# EAGLE design scn (EAGLE 9.6.2)

## Sheet 1 of 4
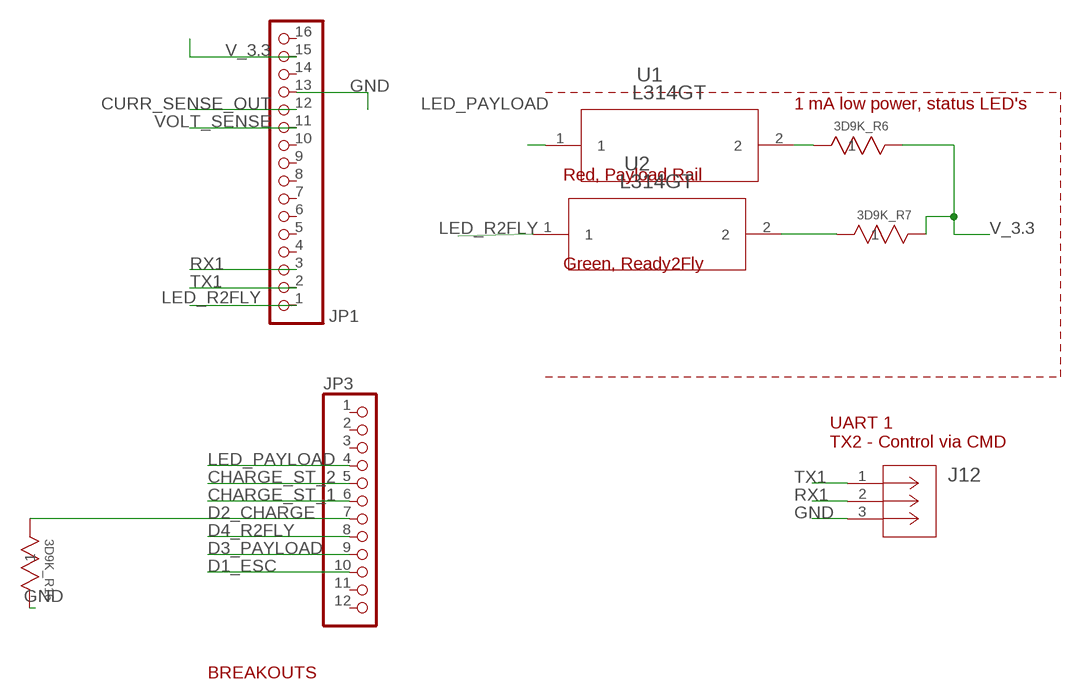
[diagram p0: schematic, sheet 1]

### Parts
3D9K_R6  CF14JT10K0  [STA_CF14_STP]
3D9K_R7  CF14JT10K0  [STA_CF14_STP]
3D9K_R16  CF14JT10K0  [STA_CF14_STP]
J12  B03B-PASK(LF)(SN)  [CONN_B03B-PASK_JST]
JP1  HEADER-1X16ROUND  [1X16_ROUND]
JP3  HEADER-1X12  [1X12_ROUND]
U1  L314GT  [L314GT_AOP]
U2  L314GT  [L314GT_AOP]

### Nets
CHARGE_ST_1: JP3.6 ; also sheet 3
CHARGE_ST_2: JP3.5 ; also sheet 3
CURR_SENSE_OUT: JP1.12 ; also sheet 3
D1_ESC: JP3.10 ; also sheet 3
D2_CHARGE: 3D9K_R16.1 JP3.7 ; also sheet 3
D3_PAYLOAD: JP3.9 ; also sheet 4
D4_R2FLY: JP3.8
GND: 3D9K_R16.2 J12.3 JP1.13 ; also sheet 2,3,4
LED_PAYLOAD: JP3.4 U1.1
LED_R2FLY: JP1.1 U2.1
N$9: 3D9K_R6.1 U1.2
N$11: 3D9K_R7.1 U2.2
RX1: J12.2 JP1.3
TX1: J12.1 JP1.2
V_3.3: 3D9K_R6.2 3D9K_R7.2 JP1.15 ; also sheet 3,4
VOLT_SENSE: JP1.11
Unconnected: JP1.4 JP1.5 JP1.6 JP1.7 JP1.8 JP1.9 JP1.10 JP1.14 JP1.16 JP3.1 JP3.2 JP3.3 JP3.11 JP3.12

### Notes on the sheet
- 1 mA low power, status LED's
- Red, Payload Rail
- Green, Ready2Fly
- UART 1
  TX2 - Control via CMD
- BREAKOUTS

## Sheet 2 of 4
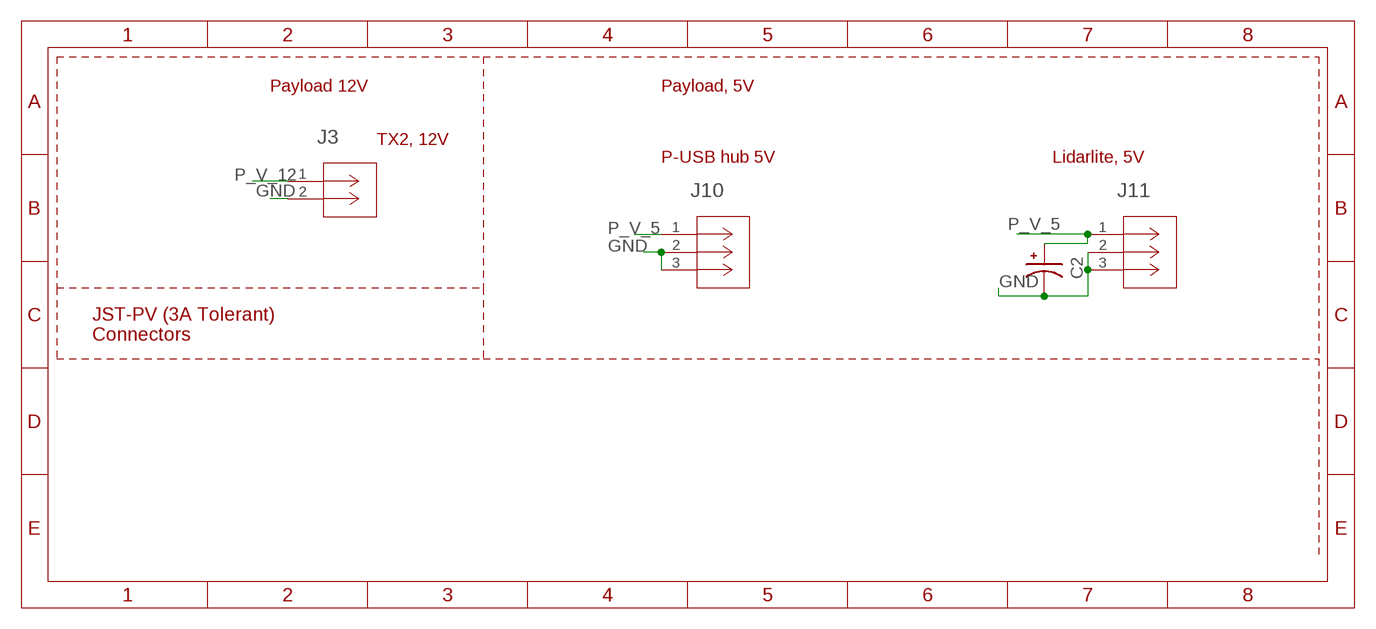
[diagram p1: schematic, sheet 2]

### Parts
C2  ECA1CM471  [CAPPRD350W60D800H1150]
J3  B02B-PASK(LF)(SN)  [CONN_B02B-PASK(LF)(SN)_JST]
J10  B03B-PASK(LF)(SN)  [CONN_B03B-PASK_JST]
J11  B03B-PASK(LF)(SN)  [CONN_B03B-PASK_JST]

### Nets
GND: C2.N J3.2 J10.2 J10.3 J11.2 J11.3 ; also sheet 1,3,4
P_V_5: C2.P J10.1 J11.1 ; also sheet 4
P_V_12: J3.1 ; also sheet 3,4

### Notes on the sheet
- Payload 12V | Payload, 5V
- TX2, 12V
- P-USB hub 5V | Lidarlite, 5V
- JST-PV (3A Tolerant)
  Connectors

## Sheet 3 of 4
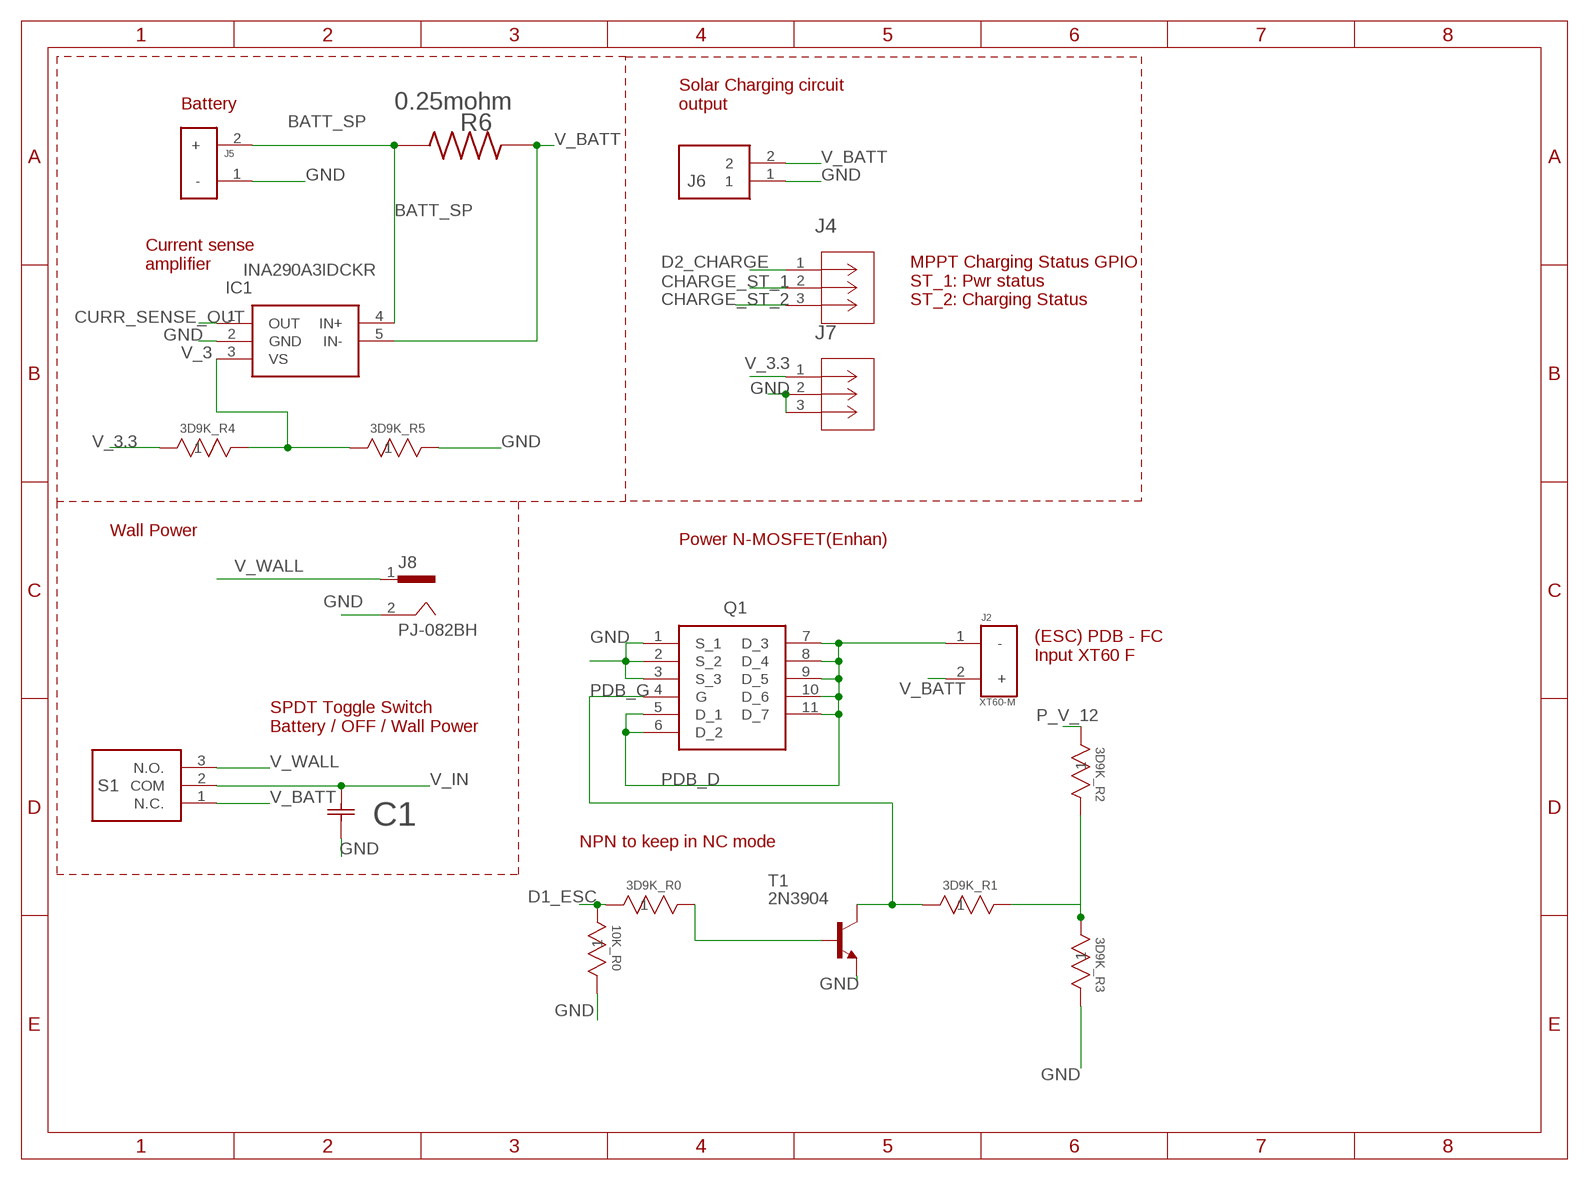
[diagram p2: schematic, sheet 3]

### Parts
3D9K_R0  CF14JT10K0  [STA_CF14_STP]
3D9K_R1  CF14JT10K0  [STA_CF14_STP]
3D9K_R2  CF14JT10K0  [STA_CF14_STP]
3D9K_R3  CF14JT10K0  [STA_CF14_STP]
3D9K_R4  CF14JT10K0  [STA_CF14_STP]
3D9K_R5  CF14JT10K0  [STA_CF14_STP]
10K_R0  CF14JT10K0  [STA_CF14_STP]
C1  25PX1000MEFCT810X16  [CAP_PK/PZ_10X16_LOW_RUB]
IC1  INA290A3IDCKR  [SOT65P210X110-5N]
J2  XT60-M  [AMASS_XT60-M]
J4  B03B-PASK(LF)(SN)  [CONN_B03B-PASK_JST]
J5  XT60-M  [AMASS_XT60-M]
J6  XT30UPB-M  [SHDR2W160P0X500_1X2_1020X520X1]
J7  B03B-PASK(LF)(SN)  [CONN_B03B-PASK_JST]
J8  PJ-082BH  [CUI_PJ-082BH]
Q1  SIRA50DP-T1-RE3  [SI7852ADPT1GE3]
R6  0.25mohm  CSS2725FTL250  [RESC6864X124N]
S1  48ASSP3S1M2QBT  [48ASSP3S1M2QBT]
T1  2N3904  [TO92]

### Nets
BATT_SP: IC1.4(IN+) J5.2(+) R6.1
CHARGE_ST_1: J4.2 ; also sheet 1
CHARGE_ST_2: J4.3 ; also sheet 1
CURR_SENSE_OUT: IC1.1(OUT) ; also sheet 1
D1_ESC: 3D9K_R0.1 10K_R0.1 ; also sheet 1
D2_CHARGE: J4.1 ; also sheet 1
GND: 3D9K_R3.2 3D9K_R5.2 10K_R0.2 C1.2 IC1.2(GND) J5.1(-) J6.1 J7.2 J7.3 J8.2 Q1.1(S_1) Q1.2(S_2) Q1.3(S_3) T1.3(E) ; also sheet 1,2,4
N$1: 3D9K_R1.2 3D9K_R2.2 3D9K_R3.1
N$6: 3D9K_R0.2 T1.2(B)
P_V_12: 3D9K_R2.1 ; also sheet 2,4
PDB_D: J2.1(-) Q1.5(D_1) Q1.6(D_2) Q1.7(D_3) Q1.8(D_4) Q1.9(D_5) Q1.10(D_6) Q1.11(D_7)
PDB_G: 3D9K_R1.1 Q1.4(G) T1.1(C)
V_3: 3D9K_R4.2 3D9K_R5.1 IC1.3(VS)
V_3.3: 3D9K_R4.1 J7.1 ; also sheet 1,4
V_BATT [Full_Voltage]: IC1.5(IN-) J2.2(+) J6.2 R6.2 S1.1(N.C.)
V_IN [v_in]: C1.1 S1.2(COM) ; also sheet 4
V_WALL [Full_Voltage]: J8.1 S1.3(N.O.)

### Notes on the sheet
- Battery
- Solar Charging circuit
  output
- Current sense
  amplifier
- MPPT Charging Status GPIO
  ST_1: Pwr status
  ST_2: Charging Status
- Wall Power
- Power N-MOSFET(Enhan)
- (ESC) PDB - FC 
  Input XT60 F
- SPDT Toggle Switch
  Battery / OFF / Wall Power
- NPN to keep in NC mode

## Sheet 4 of 4
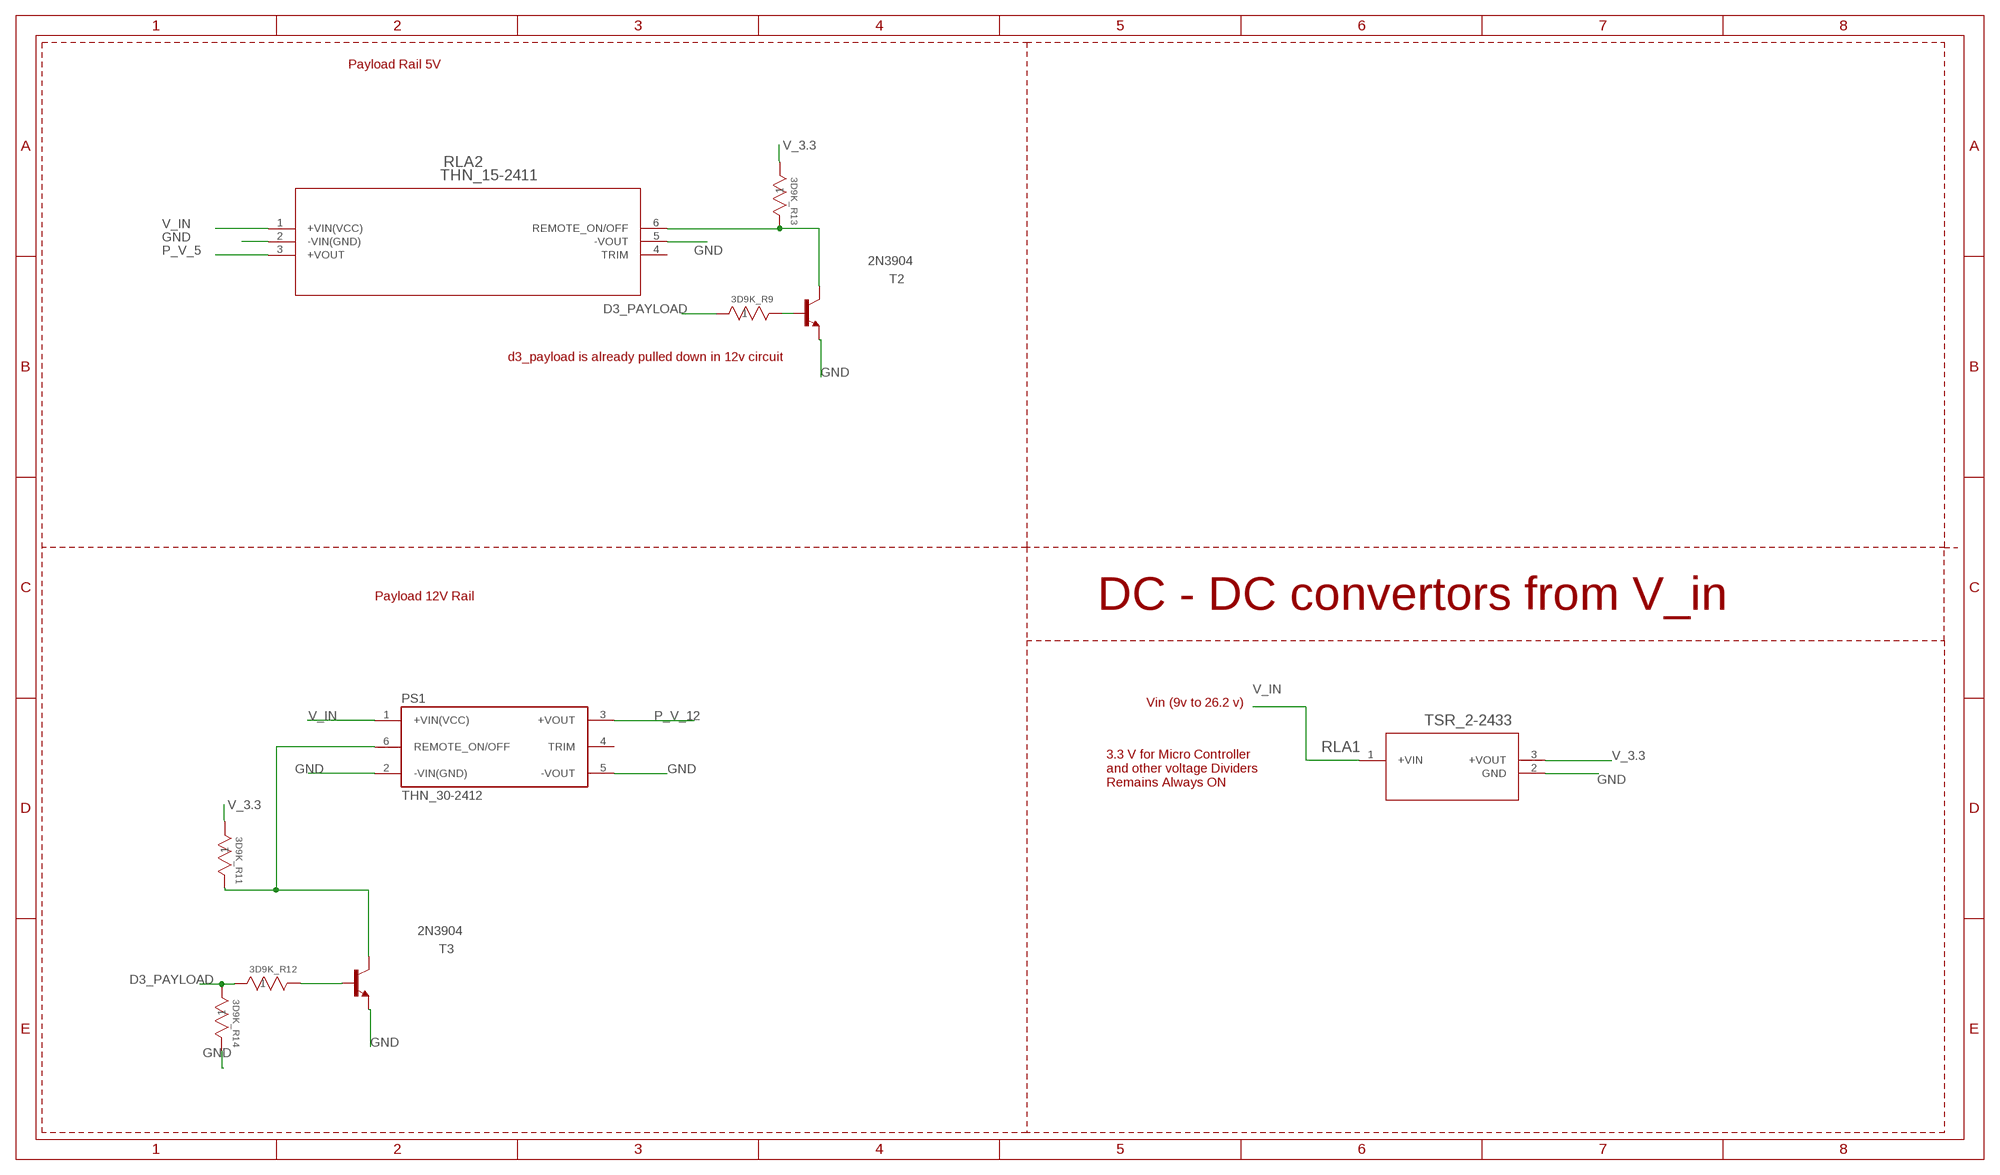
[diagram p3: schematic, sheet 4]

### Parts
3D9K_R9  CF14JT10K0  [STA_CF14_STP]
3D9K_R11  CF14JT10K0  [STA_CF14_STP]
3D9K_R12  CF14JT10K0  [STA_CF14_STP]
3D9K_R13  CF14JT10K0  [STA_CF14_STP]
3D9K_R14  CF14JT10K0  [STA_CF14_STP]
PS1  THN_30-2412  [CONV_THN_30-2412]
RLA1  TSR_2-2433  [TSR2-SINGLE_TRP]
RLA2  THN_15-2411  [THN15-SINGLE_TRP]
T2  2N3904  [TO92]
T3  2N3904  [TO92]

### Nets
D3_PAYLOAD: 3D9K_R9.1 3D9K_R12.1 3D9K_R14.1 ; also sheet 1
GND: 3D9K_R14.2 PS1.2(-VIN(GND)) PS1.5(-VOUT) RLA1.2(GND) RLA2.2(-VIN(GND)) RLA2.5(-VOUT) T2.3(E) T3.3(E) ; also sheet 1,2,3
N$2: 3D9K_R13.2 RLA2.6(REMOTE_ON/OFF) T2.1(C)
N$3: 3D9K_R9.2 T2.2(B)
N$5: 3D9K_R12.2 T3.2(B)
N$7: 3D9K_R11.2 PS1.6(REMOTE_ON/OFF) T3.1(C)
P_V_5: RLA2.3(+VOUT) ; also sheet 2
P_V_12: PS1.3(+VOUT) ; also sheet 2,3
V_3.3: 3D9K_R11.1 3D9K_R13.1 RLA1.3(+VOUT) ; also sheet 1,3
V_IN [v_in]: PS1.1(+VIN(VCC)) RLA1.1(+VIN) RLA2.1(+VIN(VCC)) ; also sheet 3
Unconnected: PS1.4(TRIM) RLA2.4(TRIM)

### Notes on the sheet
- Payload Rail 5V
- d3_payload is already pulled down in 12v circuit
- Payload 12V Rail
- DC - DC convertors from V_in
- Vin (9v to 26.2 v)
- 3.3 V for Micro Controller 
  and other voltage Dividers
  Remains Always ON

## Library data of the parts
3D9K_R0 3D9K_R1-3D9K_R7 3D9K_R9 3D9K_R11-3D9K_R14 3D9K_R16 10K_R0 = resistor_through:CF14JT10K0; COPYRIGHT: Copyright (C) 2022 Ultra Librarian. All rights reserved.; DIGI-KEY_PART_NUMBER_1: CF14JT10K0CT-ND; DIGI-KEY_PART_NUMBER_2: CF14JT10K0TR-ND; MANUFACTURER_PART_NUMBER: CF14JT10K0; MFR_NAME: Stackpole International
C1 = al_cap_1000uF:25PX1000MEFCT810X16; COPYRIGHT: Copyright (C) 2022 Ultra Librarian. All rights reserved.; DIGI-KEY_PART_NUMBER_1: 1189-1583-1-ND; DIGI-KEY_PART_NUMBER_2: 1189-1583-3-ND; DIGI-KEY_PART_NUMBER_3: 1189-1583-3-NDL; MANUFACTURER_PART_NUMBER: 25PX1000MEFCT810X16; MFR_NAME: Rubycon
C2 = ECA1CM471:ECA1CM471: M-A; DESCRIPTION: 470F 16V Aluminum Electrolytic Capacitors Radial, Can 2000 Hrs @ 85C; DIGI-KEY_PART_NUMBER: P5141-ND; MF: Panasonic; MP: ECA1CM471; PACKAGE: RADIAL-2 Panasonic; PURCHASE-URL: https://pricing.snapeda.com/search/part/ECA1CM471/?ref=eda
IC1 = INA290A3IDCKR:INA290A3IDCKR: Current Sense Amplifiers 2.7 to 110V, 800kHz, ultra-precise current sense amplifier in small (sc-70) package 5-SC70 -40 to 125 Source: Datasheet <http://www.ti.com/general/docs/lit/getliterature.tsp?genericPartNumber=INA290&fileType=pdf>; DESCRIPTION: Current Sense Amplifiers 2.7 to 110V, 800kHz, ultra-precise current sense amplifier in small (sc-70) package 5-SC70 -40 to 125; HEIGHT: 1.1mm; MANUFACTURER_NAME: Texas Instruments; MANUFACTURER_PART_NUMBER: INA290A3IDCKR; MOUSER_PART_NUMBER: 595-INA290A3IDCKR; MOUSER_PRICE-STOCK: https://www.mouser.co.uk/ProductDetail/Texas-Instruments/INA290A3IDCKR/?qs=sPbYRqrBIVlSd3xQKh8yNQ%3D%3D
J2 J5 = XT60-M:XT60-M: DC supply; XT60; male; PIN:2; for cable; soldered; 60A; 500V; AVAILABILITY: Unavailable; DESCRIPTION: Plug; DC supply; XT60; male; PIN: 2; for cable; soldered; 30A; 500V; MF: AMASS; MP: XT60-M; PACKAGE: Package; PRICE: None
J3 = B02B-PASK:B02B-PASK(LF)(SN); COPYRIGHT: Copyright (C) 2022 Ultra Librarian. All rights reserved.; DIGI-KEY_PART_NUMBER_1: 455-1817-ND; MANUFACTURER_PART_NUMBER: B02B-PASK(LF)(SN); MFR_NAME: JST
J4 J7 J10-J12 = B03B-PASK:B03B-PASK(LF)(SN); COPYRIGHT: Copyright (C) 2022 Ultra Librarian. All rights reserved.; DIGI-KEY_PART_NUMBER_1: 455-1818-ND; MANUFACTURER_PART_NUMBER: B03B-PASK(LF)(SN); MFR_NAME: JST
J6 = XT30UPB-M:XT30UPB-M: Socket; DC supply; XT30; male; PIN: 2; on PCBs; THT; Colour: yellow Source: Datasheet <https://www.tme.eu/Document/4acc913878197f8c2e30d4b8cdc47230/XT30UPB SPEC.pdf>; DESCRIPTION: Socket; DC supply; XT30; male; PIN: 2; on PCBs; THT; Colour: yellow; HEIGHT: 10.7mm; MANUFACTURER_NAME: Amass; MANUFACTURER_PART_NUMBER: XT30UPB-M
J8 = PJ-082BH:PJ-082BH: 2.5 mm Center Pin, 10 A, Right Angle, Through Hole, Shielded, Dc Power Jack Connector Check availability <https://pricing.snapeda.com/parts/PJ-082BH/CUI%20Devices/view-part?ref=eda>; AVAILABILITY: In Stock; CUI_PURCHASE_URL: https://www.cuidevices.com/product/interconnect/connectors/dc-power-connectors/jacks/pj-082bh?utm_source=snapeda.com&utm_medium=referral&utm_campaign=snapedaBOM; DESCRIPTION: 2.5 x 6.5 mm, 10.0 A, Horizontal, Through Hole, Shielded, Dc Power Jack Connector; MF: CUI Devices; MP: PJ-082BH; PACKAGE: None; PRICE: None; PURCHASE-URL: https://pricing.snapeda.com/search/part/PJ-082BH/?ref=eda
JP1 = microbuilder:HEADER-1X16: PIN HEADER
JP3 = microbuilder:HEADER-1X12
PS1 = THN_30-2412:THN_30-2412; DESCRIPTION: 30 Watt DC/DC converter, industrial, 2:1 input, encpasulated, 1.0 x 1.0 metal package; DIGI-KEY_PART_NUMBER: 1951-2307-ND; MF: Traco Power; MP: THN 30-2412; PACKAGE: 1&quot; X 1&quot; Traco Power; PURCHASE-URL: https://pricing.snapeda.com/search/part/THN 30-2412/?ref=eda
Q1 = SIRA50DP-T1-RE3:SIRA50DP-T1-RE3: MOSFET 40V Vds 20V Vgs PowerPAK SO-8 Source: Datasheet <https://ms.componentsearchengine.com/Datasheets/2/SIRA50DP-T1-RE3.pdf>; ARROW_PART_NUMBER: SIRA50DP-T1-RE3; ARROW_PRICE-STOCK: https://www.arrow.com/en/products/sira50dp-t1-re3/vishay; DESCRIPTION: MOSFET 40V Vds 20V Vgs PowerPAK SO-8; HEIGHT: 1.12mm; MANUFACTURER_NAME: Vishay; MANUFACTURER_PART_NUMBER: SIRA50DP-T1-RE3; MOUSER_PART_NUMBER: 78-SIRA50DP-T1-RE3; MOUSER_PRICE-STOCK: https://www.mouser.co.uk/ProductDetail/Vishay-Siliconix/SIRA50DP-T1-RE3/?qs=chTDxNqvsykRqxCKz2maeQ%3D%3D
R6 = CSS2725FTL250:CSS2725FTL250: Res Metal Alloy 2725 0.00025 Ohm 1% 4W ±50ppm/°C Pad SMD Automotive T/R; DESCRIPTION: 250 µOhms ±1% 4W Chip Resistor Nonstandard Automotive AEC-Q200, Current Sense Metal Element; DIGI-KEY_PART_NUMBER: CSS2725FTL250CT-ND; MF: Stackpole Electronics Inc; MP: CSS2725FTL250; PACKAGE: 6864 Stackpole; PURCHASE-URL: https://pricing.snapeda.com/search/part/CSS2725FTL250/?ref=eda
RLA1 = TSR2-2433:TSR_2-2433; BUILT_BY: EMA_Justin; COPYRIGHT: Copyright (C) 2018 Accelerated Designs. All rights reserved; DATASHEET: https://www.tracopower.com/products/tsr2.pdf; MANUFACTURER_PART_NUMBER: TSR 2-2433; SOURCELIBRARY: Traco_Power_2020-06-03; VENDOR: Traco Power
RLA2 = THN_15-2411:THN_15-2411; COPYRIGHT: Copyright (C) 2022 Ultra Librarian. All rights reserved.; DIGI-KEY_PART_NUMBER_1: 1951-1002-ND; MANUFACTURER_PART_NUMBER: THN 15-2411; MFR_NAME: Traco Power
S1 = 48ASSP3S1M2QBT:48ASSP3S1M2QBT: Slide Switches Slide Switch, SPDT, ON-OFF-ON, thru-hole, PC Mount, RoHS Compliant Source: Datasheet <http://www.grayhill.com/assets/1/7/48a_slide.pdf>; ARROW_PART_NUMBER: 48ASSP3S1M2QBT; ARROW_PRICE-STOCK: https://www.arrow.com/en/products/48assp3s1m2qbt/grayhill; DESCRIPTION: Slide Switches Slide Switch, SPDT, ON-OFF-ON, thru-hole, PC Mount, RoHS Compliant; HEIGHT: 11.43mm; MANUFACTURER_NAME: Grayhill; MANUFACTURER_PART_NUMBER: 48ASSP3S1M2QBT; MOUSER_PART_NUMBER: 706-48ASSP3S1M2QBT; MOUSER_PRICE-STOCK: https://www.mouser.co.uk/ProductDetail/Grayhill/48ASSP3S1M2QBT?qs=ls7QRyWmRk4lulZ551e6Sw%3D%3D
T1-T3 = transistor:2N3904: NPN TRANSISTOR
U1 U2 = led_hole:L314GT; COPYRIGHT: Copyright (C) 2022 Ultra Librarian. All rights reserved.; DIGI-KEY_PART_NUMBER_1: 2460-L314GT-ND; MANUFACTURER_PART_NUMBER: L314GT; MFR_NAME: American Opto Plus

## Net classes
2 v_in: width 0.8 mm
3 def: width 0.254 mm

## Board
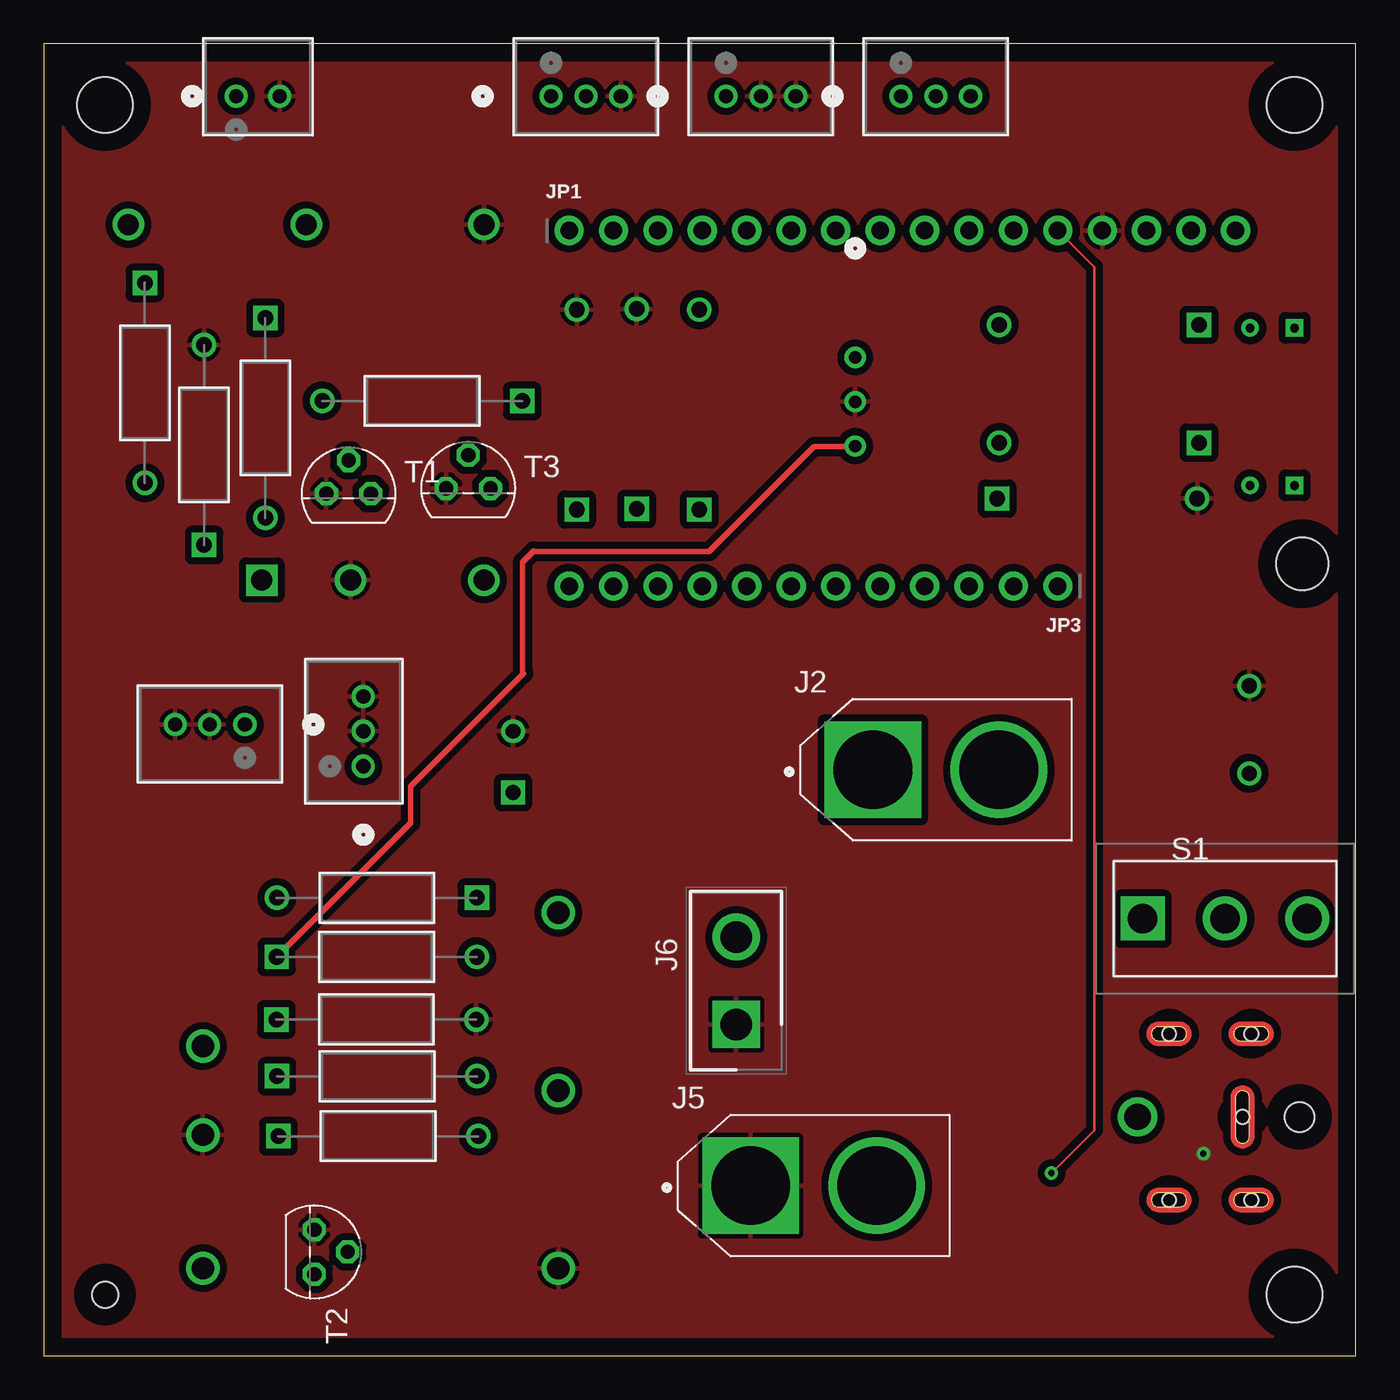
[diagram p4: board, top side]
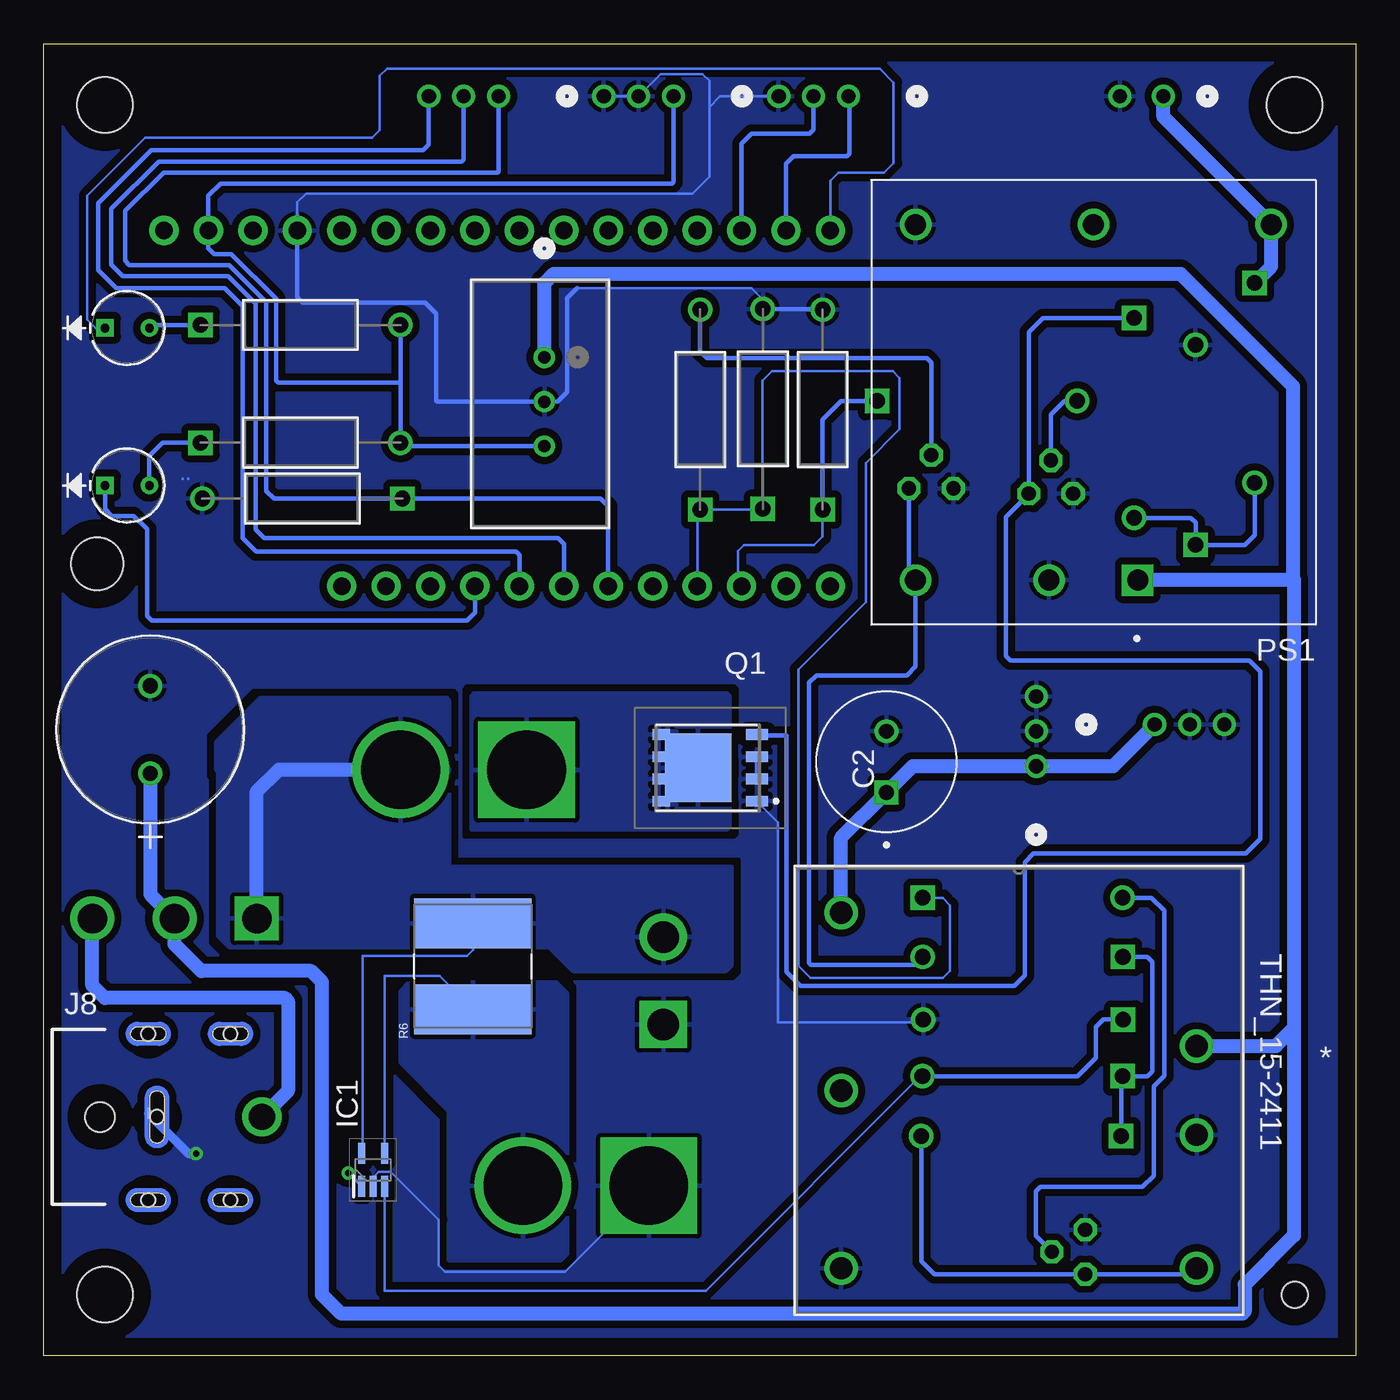
[diagram p5: board, bottom side, seen from below]

Size 75 x 75 mm. Coordinates in mm from the lower left corner, seen from the top.
Outline: 0,0 75,0 75,75 0,75 0,0
Copper layers (1*16): Top 0.035mm / dielectric 1.5mm / Bottom 0.035mm
Design rules "default *": minimum track width 6mil, minimum drill 0.35mm, track to track 6mil, track to pad 6mil, pad to pad 6mil, via to via 6mil, smd to smd 6mil, copper to edge 40mil, drill to drill 6mil, minimum pad ring 10mil, minimum via ring 8mil, stop-mask expansion 4mil, vias tented up to drill 0mil, thermal gap 10mil
Holes 3.2 mm at 3.5,71.5 71.5,71.5 71.5,3.5
Holes 1.5 mm at 3.5,3.5
Holes 3 mm at 71.94,45.27

### Footprints (pad centres in the part's own frame; a part is rotated, then mirrored left to right if it is on the bottom)
STA_CF14_STP = drill 0.889 pad 1.397 square: 1 0,0 | drill 0.889 pad 1.397: 2 11.43,0
CAP_PK/PZ_10X16_LOW_RUB = drill 0.864 pad 1.372: 1 0,0; 2 5.004,0
CAPPRD350W60D800H1150 = drill 0.85 pad 1.2: N 1.75,0 | drill 0.85 pad 1.2 square: P -1.75,0
SOT65P210X110-5N = smd 1.2 x 0.4: 1 -0.95,0.65; 2 -0.95,0; 3 -0.95,-0.65; 4 0.95,-0.65; 5 0.95,0.65
AMASS_XT60-M = drill 4.5 square: 1 -3.6,0 | drill 4.5: 2 3.6,0
CONN_B02B-PASK(LF)(SN)_JST = drill 0.813 pad 1.321: 1 0,0; 2 -2.489,0
CONN_B03B-PASK_JST = drill 0.813 pad 1.321: 1 0,0; 2 2.007,0; 3 3.988,0
SHDR2W160P0X500_1X2_1020X520X1 = drill 1.8 pad 2.7 square: 1 0,0 | drill 1.8 pad 2.7: 2 5,0
CUI_PJ-082BH = drill 1.5: 1 5.5,0 | smd 0.1 x 0.635: 2 -1,0.2 | hole 0.8: -1,-4.75; -0.5,0; -1,4.75; 3.7,-4.75; 3.7,4.75 | hole 1.7: -3.75,0
1X16_ROUND = drill 1 pad 1.676: 1 -19.05,0; 2 -16.51,0; 3 -13.97,0; 4 -11.43,0; 5 -8.89,0; 6 -6.35,0; 7 -3.81,0; 8 -1.27,0; 9 1.27,0; 10 3.81,0; 11 6.35,0; 12 8.89,0; 13 11.43,0; 14 13.97,0; 15 16.51,0; 16 19.05,0
1X12_ROUND = drill 1 pad 1.676: 1 -13.97,0; 2 -11.43,0; 3 -8.89,0; 4 -6.35,0; 5 -3.81,0; 6 -1.27,0; 7 1.27,0; 8 3.81,0; 9 6.35,0; 10 8.89,0; 11 11.43,0; 12 13.97,0
CONV_THN_30-2412 = drill 1.2 pad 1.8 square: 1 -2.54,10.16 | drill 1.2 pad 1.8: 2 2.54,10.16; 3 -10.16,-10.16; 4 0,-10.16; 5 10.16,-10.16; 6 10.16,10.16
SI7852ADPT1GE3 = smd 1.27 x 0.61: 1 -2.81,1.905; 2 -2.81,0.635; 3 -2.81,-0.635; 4 -2.81,-1.905 | smd 0.71 x 0.61: 5 2.81,-1.905; 6 2.81,-0.635; 7 2.81,0.635; 8 2.81,1.905 | smd 3.81 x 3.91: 9 0.55,0 | smd 0.31 x 0.255: 10 2.3,2.083; 11 2.3,-2.083
RESC6864X124N = smd 2.86 x 6.71: 1 -2.456,0; 2 2.456,0
TSR2-SINGLE_TRP = drill 0.711 pad 1.219: 1 0,0; 2 2.54,0; 3 5.08,0
THN15-SINGLE_TRP = drill 1.27 pad 1.778: 1 0,0; 2 0,-5.08; 3 -20.32,7.62; 4 -20.32,-2.54; 5 -20.32,-12.7; 6 0,-12.7
48ASSP3S1M2QBT = drill 1.68 pad 2.52 square: 1 0,0 | drill 1.68 pad 2.52: 2 4.7,0; 3 9.4,0
TO92 = drill 0.813 octagon: 1 1.27,0; 2 0,1.905; 3 -1.27,0
L314GT_AOP = drill 0.508 pad 1.016 square: 1 0,0 | drill 0.508 pad 1.016: 2 2.54,0

### Placement (x,y rotation side)
3D9K_R0  27.35,54.58 180 top
3D9K_R1  12.67,59.33 270 top
3D9K_R2  5.78,61.33 270 top
3D9K_R3  9.16,46.35 90 top
3D9K_R4  13.34,15.98 0 top
3D9K_R5  13.29,19.23 0 top
3D9K_R6  66.04,52.2 0 bottom
3D9K_R7  66.04,58.93 0 bottom
3D9K_R9  24.75,26.18 180 top
3D9K_R11  13.31,22.8 0 top
3D9K_R12  37.47,48.37 90 bottom
3D9K_R13  13.4,12.55 0 top
3D9K_R14  33.89,48.41 90 bottom
3D9K_R16  54.5,49 180 bottom
10K_R0  30.47,48.37 90 bottom
C1  68.91,33.29 90 bottom
C2  26.83,33.95 90 bottom
IC1  56.18,10.63 90 bottom
J2  51,33.5 0 top
J3  11,72 180 top
J4  49,72 0 top
J5  44.01,9.73 0 top
J6  39.58,18.94 90 top
J7  39,72 0 top
J8  68.02,13.65 0 bottom
J10  18.27,33.7 90 top
J11  11.5,36.09 180 top
J12  29,72 0 top
JP1  49.08,64.32 0 top
JP3  44,44 180 top
PS1  15,54.5 180 bottom
Q1  37.04,33.61 180 bottom
R6  50.47,22.27 90 bottom
RLA1  46.38,57.08 270 bottom
RLA2  9.1,17.7 0 bottom
S1  62.82,25 0 top
T1  17.43,49.28 0 top
T2  15.47,5.93 270 top
T3  24.27,49.58 0 top
U1  71.5,49.75 0 bottom
U2  71.5,58.75 0 bottom

### Tracks (layer width: path | path; a pad name or v marks a point on that pad's centre or on a via)
BATT_SP
  Bottom 0.152: R6.1 52.38,21.72 55.53,21.72 IC1.4
  pour Bottom (isolate 0.406): 45.09,5.84 45.09,20.7 45.72,21.34 54.1,21.34 54.61,20.83 54.61,16.76 51.82,13.97 51.82,5.46 45.47,5.46
CHARGE_ST_1
  Bottom 0.254: J4.2 51.01,68.37 51.11,68.27 68.43,68.27 71.13,65.57 71.13,62.37 70.48,61.72 64.44,61.72 62.88,60.16 62.88,47.23 62.39,46.74 45.59,46.74 45.27,46.41 JP3.6
CHARGE_ST_2
  Bottom 0.254: JP3.5 47.81,45.78 48.01,45.97 62.87,45.97 63.63,46.73 63.63,60 64.66,61.03 70.84,61.03 71.88,62.07 71.88,65.88 68.86,68.91 53.32,68.91 52.99,69.23 J4.3
CURR_SENSE_OUT  (via drill 0.35)
  Top 0.152: JP1.12 60.06,62.23 60.06,12.89 v57.61,10.44
  Bottom 0.152: v57.61,10.44 56.84,9.68 IC1.1
D1_ESC
  Bottom 0.152: 10K_R0.1 30.47,46.82 30.96,46.33 34.98,46.33 35.3,46 35.3,44.2 JP3.10
  Bottom 0.254: 10K_R0.1 30.47,53.53 29.42,54.58 3D9K_R0.1
D2_CHARGE
  Bottom 0.254: JP3.7 42.73,48.57 43.16,49 3D9K_R16.1 61.84,49 62.28,49.44 62.28,60.22 64.41,62.36 70.1,62.36 70.33,62.59 70.33,65.44 68.14,67.64 49.06,67.64 49,67.7 J4.1
D3_PAYLOAD
  Bottom 0.152: JP3.9 37.62,44.03 37.62,48.22 3D9K_R12.1 33.93,48.37 3D9K_R14.1 33.91,48.43 33.91,55.75 33.38,56.28 26.46,56.28 26.07,55.89 26.07,52.97 28,51.04 28,43.09 31.86,39.23 31.86,22.28 31.17,21.59 23.6,21.59 23.19,22.01 23.19,25.75 23.61,26.18 3D9K_R9.1
GND  (via drill 0.35)
  Bottom 0.152: Q1.3 34.29,34.29 34.29,33.02 Q1.2 | 3D9K_R5.2 25.4,19.05 33.02,19.05 33.02,30.48 34.29,31.75 Q1.1 | 40.39,9.68 J5.1 40.39,9.6 45.19,4.8 52.05,4.8 52.43,5.18 52.43,7.77 55.17,10.52 55.85,10.52 56.16,10.21 56.16,9.68 IC1.2 | 3D9K_R16.2 65.99,49 65.99,48.91 | J7.3 J7.2 39.75,73.26 39.75,73.27 37.34,73.27 36.96,72.89 36.96,71.37 | JP1.13 60.51,65.94 60.01,66.44 37.92,66.44 36.96,67.41 36.96,71.37 | J12.3 36.33,72 36.96,71.37 | 44.51,61.03 34.54,61.03 33.89,60.38 3D9K_R14.2 | 67.06,50.14 67.06,50.12 | 66.75,50.14 66.75,50.1
  Bottom 0.254: 3D9K_R14.2 30.51,59.84 10K_R0.2 | JP1.13 60.51,60.51 60.2,60.2 53.21,60.2 52.58,59.56 52.58,54.61 52.51,54.54 RLA1.2 45.62,54.54 45.09,55.07 45.09,60.45 44.51,61.03
  Bottom 0.508: J8.2 66.73,11.56 v66.29,11.56
  pour Bottom (isolate 1.27, rank 4): -2,78 78,78 82,74 82,-2 80,-4 -2,-4 -8,2 -8,72
  pour Bottom (isolate 0.406, rank 5): -2,80 74,80 82,72 82,6 72,-4 -4,-4 -6,-2 -6,76
  pour Top (isolate 0.406, rank 4): 0,78 82,78 86.36,73.64 86.36,4.36 74,-8 4,-8 -4,0 -4,74
LED_PAYLOAD
  Bottom 0.254: JP3.4 50.35,42.49 50.8,42.04 68.83,42.04 69.09,42.29 69.09,47.24 69.85,48.01 71.12,48.01 71.5,48.39 U1.1
LED_R2FLY
  Bottom 0.152: U2.1 72.02,58.75 72.5,59.23 72.5,66.31 69.19,69.62 56.22,69.62 55.79,70.05 55.79,73.16 55.38,73.57 27.21,73.57 26.42,72.78 26.42,68.18 26.96,67.64 29.56,67.64 30.03,67.17 JP1.1
  Bottom 0.254: JP1.1 29.97,64.38
N$1
  Bottom 0.254: 3D9K_R2.2 5.78,46.92 6.36,46.35 3D9K_R3.1 9.14,46.37 9.14,47.62 9.42,47.9 3D9K_R1.2
N$2
  Bottom 0.254: 3D9K_R13.2 24.83,5.4 24.1,4.67 T2.1 9.43,4.67 RLA2.6
N$3
  Bottom 0.254: 3D9K_R9.2 11.67,26.18 10.96,25.46 10.96,16 11.56,15.4 11.56,10.29 12.19,9.65 18.03,9.65 18.29,9.4 18.29,6.85 T2.2
N$5
  Bottom 0.254: 3D9K_R12.2 37.47,57.41 37.08,57.02 24.51,57.02 24.27,56.78 T3.2
N$6
  Bottom 0.254: 3D9K_R0.2 16.66,54.58 17.43,53.81 T1.2
N$7
  Bottom 0.254: T3.1 25.54,44.72 PS1.6 25.16,39.4 25.66,38.9 30.82,38.9 31.25,38.47 31.25,22.46 31.14,22.35 25.19,22.35 3D9K_R11.2
N$9
  Bottom 0.254: 3D9K_R6.1 68.2,52.2 68.96,51.44 U1.2
N$11
  Bottom 0.254: 3D9K_R7.1 68.79,58.93 U2.2
P_V_5
  Bottom 0.813: J11.1 13.88,33.7 J10.1 25.34,33.7 C2.P 29.41,29.62 RLA2.3
P_V_12
  Bottom 0.813: J3.1 11,70.82 PS1.3 4.84,62.27 3D9K_R2.1
PDB_D
  Bottom 0.152: Q1.10 39.4,31.55 39.62,31.55 39.78,31.7 Q1.8 | Q1.11 39.4,35.66 39.7,35.66 39.78,35.59 Q1.5
  pour Bottom (isolate 0.406): 35.81,37.72 35.81,30.23 35.94,30.1 50.55,30.1 50.55,37.72 50.42,37.85 35.94,37.85
PDB_G
  Bottom 0.254: 3D9K_R1.1 17.89,59.33 18.7,58.52 T1.1 18.7,49.25 20,47.95 20,40 19.75,39.75 6.1,39.75 5.46,39.12 5.46,29.53 6.29,28.7 18.41,28.7 18.92,28.19 18.92,21.75 19.52,21.15 31.75,21.15 32.53,21.93 32.53,35.45 34.17,35.45 Q1.4
RX1
  Bottom 0.254: J12.2 31.01,70.08 31.24,69.85 34.54,69.85 35.11,69.28 JP1.3
TX1
  Bottom 0.254: JP1.2 32.57,68.14 32.13,68.58 29.08,68.58 28.96,68.71 28.96,71.96 J12.1
V_3
  Bottom 0.152: 3D9K_R4.2 24.9,15.98 37.16,3.72 55.53,3.72 IC1.3
  Bottom 0.254: 3D9K_R4.2 15.9,15.98 14.86,17.02 14.86,18.8 14.43,19.23 3D9K_R5.1
V_3.3
  Top 0.152: 44.04,51.97 44.04,51.96 | 13.34,22.86 3D9K_R11.1
  Top 0.305: 27.39,39.03 27.39,45.39 28,46 28.04,45.96 38.04,45.96 44.04,51.96 | 27.39,39.03 27.43,38.99 | 3D9K_R11.1 20.97,30.45 20.97,32.54 27.39,38.95 27.39,39.03 | RLA1.3 46.35,51.97 44.04,51.97
  Bottom 0.152: 13.97,22.86 3D9K_R11.1
  Bottom 0.254: J7.1 39,67.09 39.08,67.01 64.9,67.01 65.59,66.32 JP1.15 65.59,63.3 65.26,62.98 64.28,62.98 61.72,60.42 61.72,55.75 61.59,55.63 54.61,55.63 | 3D9K_R7.2 54.61,55.63 | 54.61,55.63 3D9K_R6.2 54.41,52 RLA1.3 | 3D9K_R13.1 13.4,15.91 3D9K_R4.1 11.91,15.98 11.62,16.27 11.62,22.51 11.91,22.8 3D9K_R11.1
V_BATT
  Bottom 0.152: R6.2 50.47,23.19 50.8,22.86 56.77,22.86 56.77,11.64 IC1.5
  Bottom 0.813: J2.2 61.57,33.5 62.82,32.25 S1.1
  pour Bottom (isolate 0.406): 36,22 44.73,22 44.96,22.23 46.1,23.37 48.9,23.37 64.39,23.37 65.02,24 65.02,33.4 65.15,33.53 65.15,35.05 63.88,36.32 62.61,37.59 51.94,37.59 51.82,37.47 51.82,27.94 35.94,27.94 35.69,27.94 35.69,22.31
V_IN
  Bottom 0.813: C1.1 68.91,26.38 S1.2 67.52,23.52 66,22 59.72,22 59.09,21.37 59.09,3.5 58,2.41 6.48,2.41 6.35,2.54 6.35,4.06 3.54,6.87 3.54,18.73 | 12.44,44.36 PS1.1 3.66,44.34 3.59,44.41 | 3.59,44.41 3.59,55.42 10.02,61.85 45.85,61.85 46.38,61.32 RLA1.1 | 3.59,44.41 3.54,44.37 3.54,18.73 | RLA2.1 4.57,17.7 3.54,18.73
V_WALL
  Bottom 0.813: S1.3 72.22,21.17 71.5,20.45 61.21,20.45 61.03,20.26 61.03,15.15 J8.1